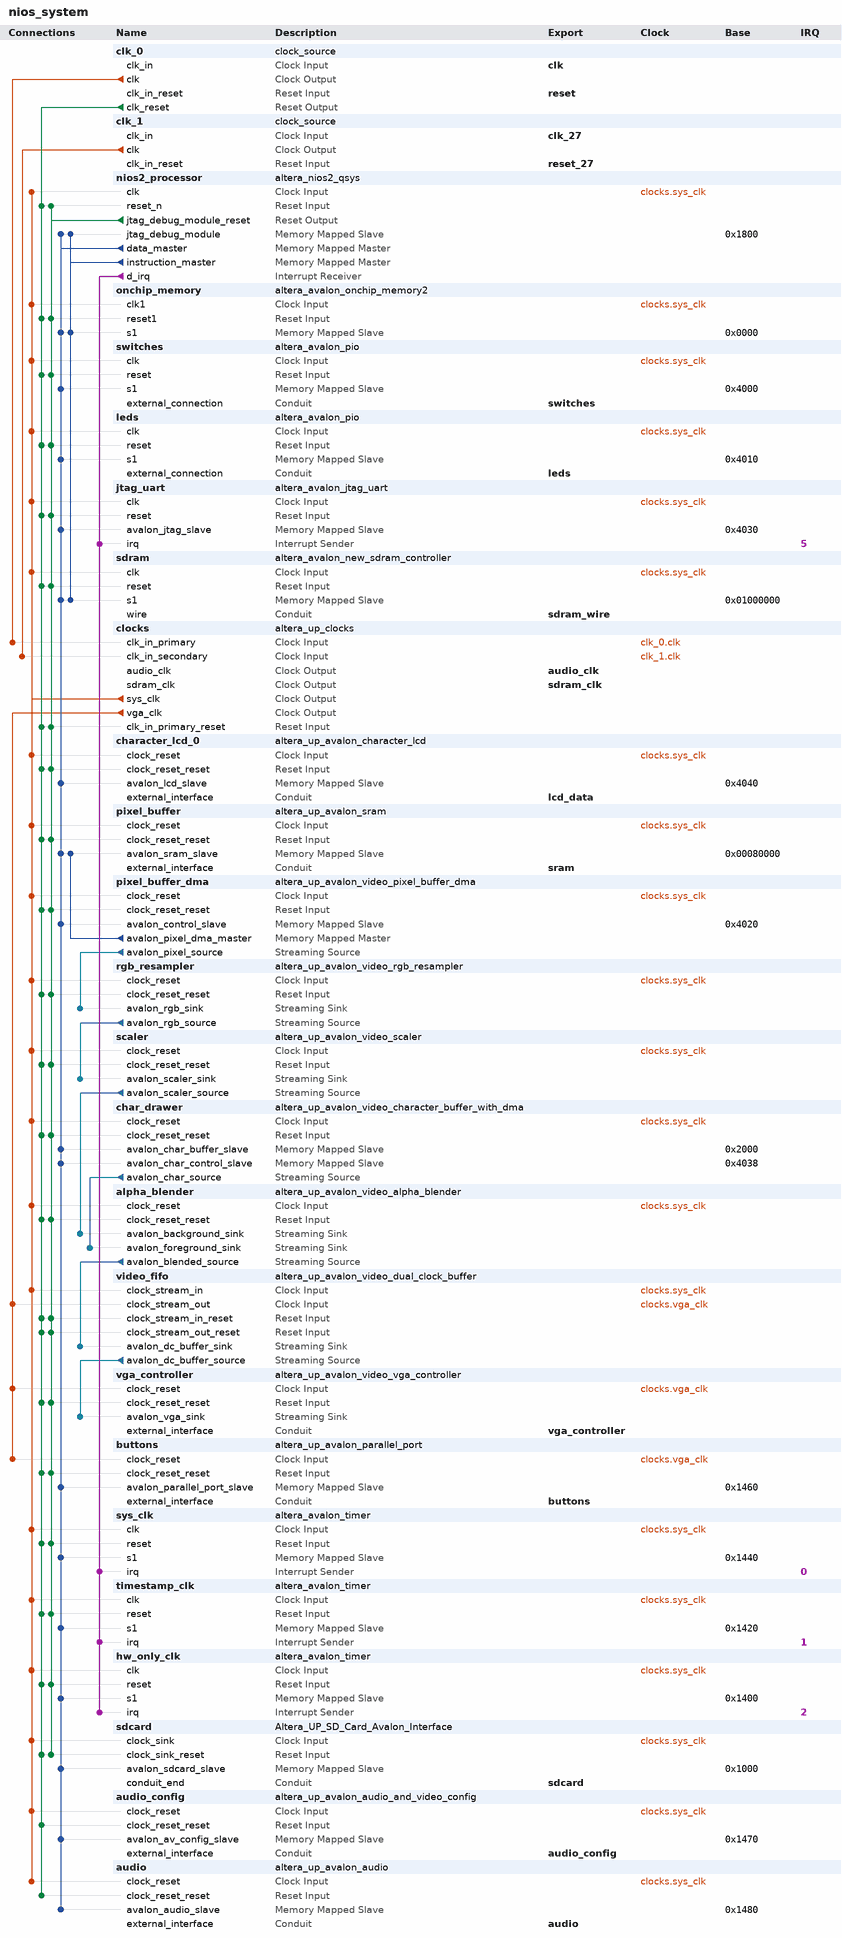
[diagram p0: system contents]
# Platform Designer (Qsys) system nios_system, Cyclone II EP2C35F672C6
# Parameters at their usual value, and those the tool derives, are not listed.
package require -exact qsys 12.0
create_system nios_system
set_project_property DEVICE_FAMILY {Cyclone II}
set_project_property DEVICE EP2C35F672C6

add_instance clk_0 clock_source 12.0
set_instance_parameter_value clk_0 clockFrequency 50000000

add_instance clk_1 clock_source 12.0
set_instance_parameter_value clk_1 clockFrequency 27000000

add_instance nios2_processor altera_nios2_qsys 12.0
set_instance_parameter_value nios2_processor resetSlave sdram.s1
set_instance_parameter_value nios2_processor exceptionSlave sdram.s1
set_instance_parameter_value nios2_processor breakSlave nios2_processor.jtag_debug_module
set_instance_parameter_value nios2_processor muldiv_multiplierType NoneSmall
set_instance_parameter_value nios2_processor impl Fast
set_instance_parameter_value nios2_processor icache_size 4096

add_instance onchip_memory altera_avalon_onchip_memory2 12.0
set_instance_parameter_value onchip_memory dataWidth 32
set_instance_parameter_value onchip_memory dualPort false
set_instance_parameter_value onchip_memory initMemContent true
set_instance_parameter_value onchip_memory initializationFileName onchip_memory
set_instance_parameter_value onchip_memory memorySize 4096

add_instance switches altera_avalon_pio 12.0
set_instance_parameter_value switches direction Input
set_instance_parameter_value switches width 18

add_instance leds altera_avalon_pio 12.0
set_instance_parameter_value leds direction Output
set_instance_parameter_value leds width 8

add_instance jtag_uart altera_avalon_jtag_uart 12.0
set_instance_parameter_value jtag_uart simInteractiveOptions INTERACTIVE_ASCII_OUTPUT

add_instance sdram altera_avalon_new_sdram_controller 12.0
set_instance_parameter_value sdram TAC 5.5
set_instance_parameter_value sdram TRCD 20.0
set_instance_parameter_value sdram TRP 20.0
set_instance_parameter_value sdram casLatency 3
set_instance_parameter_value sdram columnWidth 8
set_instance_parameter_value sdram dataWidth 16
set_instance_parameter_value sdram generateSimulationModel false
set_instance_parameter_value sdram model custom
set_instance_parameter_value sdram numberOfBanks 4
set_instance_parameter_value sdram numberOfChipSelects 1
set_instance_parameter_value sdram powerUpDelay 100.0
set_instance_parameter_value sdram refreshPeriod 15.625
set_instance_parameter_value sdram rowWidth 12

add_instance clocks altera_up_clocks 12.0
set_instance_parameter_value clocks board DE2
set_instance_parameter_value clocks vga_clk true
set_instance_parameter_value clocks audio_clk true
set_instance_parameter_value clocks audio_clk_freq 12.288

add_instance character_lcd_0 altera_up_avalon_character_lcd 12.0
set_instance_parameter_value character_lcd_0 cursor Normal

add_instance pixel_buffer altera_up_avalon_sram 12.0
set_instance_parameter_value pixel_buffer board DE2
set_instance_parameter_value pixel_buffer pixel_buffer true

add_instance pixel_buffer_dma altera_up_avalon_video_pixel_buffer_dma 12.0
set_instance_parameter_value pixel_buffer_dma addr_mode Consecutive
set_instance_parameter_value pixel_buffer_dma start_address 0
set_instance_parameter_value pixel_buffer_dma back_start_address 0
set_instance_parameter_value pixel_buffer_dma image_width 320
set_instance_parameter_value pixel_buffer_dma image_height 240
set_instance_parameter_value pixel_buffer_dma color_space {16-bit RGB}

add_instance rgb_resampler altera_up_avalon_video_rgb_resampler 12.0
set_instance_parameter_value rgb_resampler input_type {16-bit RGB}
set_instance_parameter_value rgb_resampler output_type {30-bit RGB}
set_instance_parameter_value rgb_resampler alpha 1023

add_instance scaler altera_up_avalon_video_scaler 12.0
set_instance_parameter_value scaler width_scaling 2
set_instance_parameter_value scaler height_scaling 2
set_instance_parameter_value scaler width_in 320
set_instance_parameter_value scaler color_bits 10
set_instance_parameter_value scaler color_planes 3

add_instance char_drawer altera_up_avalon_video_character_buffer_with_dma 12.0
set_instance_parameter_value char_drawer enable_transparency true

add_instance alpha_blender altera_up_avalon_video_alpha_blender 12.0

add_instance video_fifo altera_up_avalon_video_dual_clock_buffer 12.0
set_instance_parameter_value video_fifo color_bits 10

add_instance vga_controller altera_up_avalon_video_vga_controller 12.0
set_instance_parameter_value vga_controller board DE2

add_instance buttons altera_up_avalon_parallel_port 12.0
set_instance_parameter_value buttons board DE2
set_instance_parameter_value buttons preset Pushbuttons
set_instance_parameter_value buttons capture false
set_instance_parameter_value buttons edge Rising
set_instance_parameter_value buttons irq false

add_instance sys_clk altera_avalon_timer 12.0
set_instance_parameter_value sys_clk period 1
set_instance_parameter_value sys_clk periodUnits MSEC
set_instance_parameter_value sys_clk timerPreset FULL_FEATURED

add_instance timestamp_clk altera_avalon_timer 12.0
set_instance_parameter_value timestamp_clk period 1
set_instance_parameter_value timestamp_clk periodUnits MSEC
set_instance_parameter_value timestamp_clk timerPreset FULL_FEATURED

add_instance hw_only_clk altera_avalon_timer 12.0
set_instance_parameter_value hw_only_clk period 1
set_instance_parameter_value hw_only_clk periodUnits MSEC
set_instance_parameter_value hw_only_clk timerPreset FULL_FEATURED

add_instance sdcard Altera_UP_SD_Card_Avalon_Interface 1.0

add_instance audio_config altera_up_avalon_audio_and_video_config 12.0
set_instance_parameter_value audio_config board DE2
set_instance_parameter_value audio_config audio_in {Microphone to ADC}
set_instance_parameter_value audio_config line_in_bypass false
set_instance_parameter_value audio_config bit_length 16
set_instance_parameter_value audio_config sampling_rate {32 kHz}

add_instance audio altera_up_avalon_audio 12.0
set_instance_parameter_value audio avalon_bus_type {Memory Mapped}
set_instance_parameter_value audio audio_in true
set_instance_parameter_value audio dw 16

# connections
add_connection clk_0.clk clocks.clk_in_primary clock
add_connection clk_1.clk clocks.clk_in_secondary clock
add_connection clocks.sys_clk alpha_blender.clock_reset clock
add_connection clocks.sys_clk audio.clock_reset clock
add_connection clocks.sys_clk audio_config.clock_reset clock
add_connection clocks.sys_clk char_drawer.clock_reset clock
add_connection clocks.sys_clk character_lcd_0.clock_reset clock
add_connection clocks.sys_clk hw_only_clk.clk clock
add_connection clocks.sys_clk jtag_uart.clk clock
add_connection clocks.sys_clk leds.clk clock
add_connection clocks.sys_clk nios2_processor.clk clock
add_connection clocks.sys_clk onchip_memory.clk1 clock
add_connection clocks.sys_clk pixel_buffer.clock_reset clock
add_connection clocks.sys_clk pixel_buffer_dma.clock_reset clock
add_connection clocks.sys_clk rgb_resampler.clock_reset clock
add_connection clocks.sys_clk scaler.clock_reset clock
add_connection clocks.sys_clk sdcard.clock_sink clock
add_connection clocks.sys_clk sdram.clk clock
add_connection clocks.sys_clk switches.clk clock
add_connection clocks.sys_clk sys_clk.clk clock
add_connection clocks.sys_clk timestamp_clk.clk clock
add_connection clocks.sys_clk video_fifo.clock_stream_in clock
add_connection clocks.vga_clk buttons.clock_reset clock
add_connection clocks.vga_clk vga_controller.clock_reset clock
add_connection clocks.vga_clk video_fifo.clock_stream_out clock
add_connection clk_0.clk_reset alpha_blender.clock_reset_reset reset
add_connection clk_0.clk_reset audio.clock_reset_reset reset
add_connection clk_0.clk_reset audio_config.clock_reset_reset reset
add_connection clk_0.clk_reset buttons.clock_reset_reset reset
add_connection clk_0.clk_reset char_drawer.clock_reset_reset reset
add_connection clk_0.clk_reset character_lcd_0.clock_reset_reset reset
add_connection clk_0.clk_reset clocks.clk_in_primary_reset reset
add_connection clk_0.clk_reset hw_only_clk.reset reset
add_connection clk_0.clk_reset jtag_uart.reset reset
add_connection clk_0.clk_reset leds.reset reset
add_connection clk_0.clk_reset nios2_processor.reset_n reset
add_connection clk_0.clk_reset onchip_memory.reset1 reset
add_connection clk_0.clk_reset pixel_buffer.clock_reset_reset reset
add_connection clk_0.clk_reset pixel_buffer_dma.clock_reset_reset reset
add_connection clk_0.clk_reset rgb_resampler.clock_reset_reset reset
add_connection clk_0.clk_reset scaler.clock_reset_reset reset
add_connection clk_0.clk_reset sdcard.clock_sink_reset reset
add_connection clk_0.clk_reset sdram.reset reset
add_connection clk_0.clk_reset switches.reset reset
add_connection clk_0.clk_reset sys_clk.reset reset
add_connection clk_0.clk_reset timestamp_clk.reset reset
add_connection clk_0.clk_reset vga_controller.clock_reset_reset reset
add_connection clk_0.clk_reset video_fifo.clock_stream_in_reset reset
add_connection clk_0.clk_reset video_fifo.clock_stream_out_reset reset
add_connection nios2_processor.jtag_debug_module_reset alpha_blender.clock_reset_reset reset
add_connection nios2_processor.jtag_debug_module_reset buttons.clock_reset_reset reset
add_connection nios2_processor.jtag_debug_module_reset char_drawer.clock_reset_reset reset
add_connection nios2_processor.jtag_debug_module_reset character_lcd_0.clock_reset_reset reset
add_connection nios2_processor.jtag_debug_module_reset clocks.clk_in_primary_reset reset
add_connection nios2_processor.jtag_debug_module_reset hw_only_clk.reset reset
add_connection nios2_processor.jtag_debug_module_reset jtag_uart.reset reset
add_connection nios2_processor.jtag_debug_module_reset leds.reset reset
add_connection nios2_processor.jtag_debug_module_reset nios2_processor.reset_n reset
add_connection nios2_processor.jtag_debug_module_reset onchip_memory.reset1 reset
add_connection nios2_processor.jtag_debug_module_reset pixel_buffer.clock_reset_reset reset
add_connection nios2_processor.jtag_debug_module_reset pixel_buffer_dma.clock_reset_reset reset
add_connection nios2_processor.jtag_debug_module_reset rgb_resampler.clock_reset_reset reset
add_connection nios2_processor.jtag_debug_module_reset scaler.clock_reset_reset reset
add_connection nios2_processor.jtag_debug_module_reset sdcard.clock_sink_reset reset
add_connection nios2_processor.jtag_debug_module_reset sdram.reset reset
add_connection nios2_processor.jtag_debug_module_reset switches.reset reset
add_connection nios2_processor.jtag_debug_module_reset sys_clk.reset reset
add_connection nios2_processor.jtag_debug_module_reset timestamp_clk.reset reset
add_connection nios2_processor.jtag_debug_module_reset vga_controller.clock_reset_reset reset
add_connection nios2_processor.jtag_debug_module_reset video_fifo.clock_stream_in_reset reset
add_connection nios2_processor.jtag_debug_module_reset video_fifo.clock_stream_out_reset reset
add_connection nios2_processor.data_master audio.avalon_audio_slave avalon
set_connection_parameter_value nios2_processor.data_master/audio.avalon_audio_slave baseAddress 0x1480
add_connection nios2_processor.data_master audio_config.avalon_av_config_slave avalon
set_connection_parameter_value nios2_processor.data_master/audio_config.avalon_av_config_slave baseAddress 0x1470
add_connection nios2_processor.data_master buttons.avalon_parallel_port_slave avalon
set_connection_parameter_value nios2_processor.data_master/buttons.avalon_parallel_port_slave baseAddress 0x1460
add_connection nios2_processor.data_master char_drawer.avalon_char_buffer_slave avalon
set_connection_parameter_value nios2_processor.data_master/char_drawer.avalon_char_buffer_slave baseAddress 0x2000
add_connection nios2_processor.data_master char_drawer.avalon_char_control_slave avalon
set_connection_parameter_value nios2_processor.data_master/char_drawer.avalon_char_control_slave baseAddress 0x4038
add_connection nios2_processor.data_master character_lcd_0.avalon_lcd_slave avalon
set_connection_parameter_value nios2_processor.data_master/character_lcd_0.avalon_lcd_slave baseAddress 0x4040
add_connection nios2_processor.data_master hw_only_clk.s1 avalon
set_connection_parameter_value nios2_processor.data_master/hw_only_clk.s1 baseAddress 0x1400
add_connection nios2_processor.data_master jtag_uart.avalon_jtag_slave avalon
set_connection_parameter_value nios2_processor.data_master/jtag_uart.avalon_jtag_slave baseAddress 0x4030
add_connection nios2_processor.data_master leds.s1 avalon
set_connection_parameter_value nios2_processor.data_master/leds.s1 baseAddress 0x4010
add_connection nios2_processor.data_master nios2_processor.jtag_debug_module avalon
set_connection_parameter_value nios2_processor.data_master/nios2_processor.jtag_debug_module baseAddress 0x1800
add_connection nios2_processor.data_master onchip_memory.s1 avalon
set_connection_parameter_value nios2_processor.data_master/onchip_memory.s1 baseAddress 0x0000
add_connection nios2_processor.data_master pixel_buffer.avalon_sram_slave avalon
set_connection_parameter_value nios2_processor.data_master/pixel_buffer.avalon_sram_slave baseAddress 0x00080000
add_connection nios2_processor.data_master pixel_buffer_dma.avalon_control_slave avalon
set_connection_parameter_value nios2_processor.data_master/pixel_buffer_dma.avalon_control_slave baseAddress 0x4020
add_connection nios2_processor.data_master sdcard.avalon_sdcard_slave avalon
set_connection_parameter_value nios2_processor.data_master/sdcard.avalon_sdcard_slave baseAddress 0x1000
add_connection nios2_processor.data_master sdram.s1 avalon
set_connection_parameter_value nios2_processor.data_master/sdram.s1 baseAddress 0x01000000
add_connection nios2_processor.data_master switches.s1 avalon
set_connection_parameter_value nios2_processor.data_master/switches.s1 baseAddress 0x4000
add_connection nios2_processor.data_master sys_clk.s1 avalon
set_connection_parameter_value nios2_processor.data_master/sys_clk.s1 baseAddress 0x1440
add_connection nios2_processor.data_master timestamp_clk.s1 avalon
set_connection_parameter_value nios2_processor.data_master/timestamp_clk.s1 baseAddress 0x1420
add_connection nios2_processor.instruction_master nios2_processor.jtag_debug_module avalon
set_connection_parameter_value nios2_processor.instruction_master/nios2_processor.jtag_debug_module baseAddress 0x1800
add_connection nios2_processor.instruction_master onchip_memory.s1 avalon
set_connection_parameter_value nios2_processor.instruction_master/onchip_memory.s1 baseAddress 0x0000
add_connection nios2_processor.instruction_master sdram.s1 avalon
set_connection_parameter_value nios2_processor.instruction_master/sdram.s1 baseAddress 0x01000000
add_connection pixel_buffer_dma.avalon_pixel_dma_master pixel_buffer.avalon_sram_slave avalon
set_connection_parameter_value pixel_buffer_dma.avalon_pixel_dma_master/pixel_buffer.avalon_sram_slave baseAddress 0x00080000
add_connection alpha_blender.avalon_blended_source video_fifo.avalon_dc_buffer_sink avalon_streaming
add_connection char_drawer.avalon_char_source alpha_blender.avalon_foreground_sink avalon_streaming
add_connection pixel_buffer_dma.avalon_pixel_source rgb_resampler.avalon_rgb_sink avalon_streaming
add_connection rgb_resampler.avalon_rgb_source scaler.avalon_scaler_sink avalon_streaming
add_connection scaler.avalon_scaler_source alpha_blender.avalon_background_sink avalon_streaming
add_connection video_fifo.avalon_dc_buffer_source vga_controller.avalon_vga_sink avalon_streaming
add_connection nios2_processor.d_irq hw_only_clk.irq interrupt
set_connection_parameter_value nios2_processor.d_irq/hw_only_clk.irq irqNumber 2
add_connection nios2_processor.d_irq jtag_uart.irq interrupt
set_connection_parameter_value nios2_processor.d_irq/jtag_uart.irq irqNumber 5
add_connection nios2_processor.d_irq sys_clk.irq interrupt
set_connection_parameter_value nios2_processor.d_irq/sys_clk.irq irqNumber 0
add_connection nios2_processor.d_irq timestamp_clk.irq interrupt
set_connection_parameter_value nios2_processor.d_irq/timestamp_clk.irq irqNumber 1

# exported interfaces
add_interface clk clock sink
set_interface_property clk EXPORT_OF clk_0.clk_in
add_interface reset reset sink
set_interface_property reset EXPORT_OF clk_0.clk_in_reset
add_interface switches conduit end
set_interface_property switches EXPORT_OF switches.external_connection
add_interface leds conduit end
set_interface_property leds EXPORT_OF leds.external_connection
add_interface sdram_wire conduit end
set_interface_property sdram_wire EXPORT_OF sdram.wire
add_interface sdram_clk clock source
set_interface_property sdram_clk EXPORT_OF clocks.sdram_clk
add_interface lcd_data conduit end
set_interface_property lcd_data EXPORT_OF character_lcd_0.external_interface
add_interface sram conduit end
set_interface_property sram EXPORT_OF pixel_buffer.external_interface
add_interface vga_controller conduit end
set_interface_property vga_controller EXPORT_OF vga_controller.external_interface
add_interface buttons conduit end
set_interface_property buttons EXPORT_OF buttons.external_interface
add_interface sdcard conduit end
set_interface_property sdcard EXPORT_OF sdcard.conduit_end
add_interface clk_27 clock sink
set_interface_property clk_27 EXPORT_OF clk_1.clk_in
add_interface reset_27 reset sink
set_interface_property reset_27 EXPORT_OF clk_1.clk_in_reset
add_interface audio_config conduit end
set_interface_property audio_config EXPORT_OF audio_config.external_interface
add_interface audio conduit end
set_interface_property audio EXPORT_OF audio.external_interface
add_interface audio_clk clock source
set_interface_property audio_clk EXPORT_OF clocks.audio_clk

save_system nios_system.qsys
